# Altium project STM32F4.PrjPCB
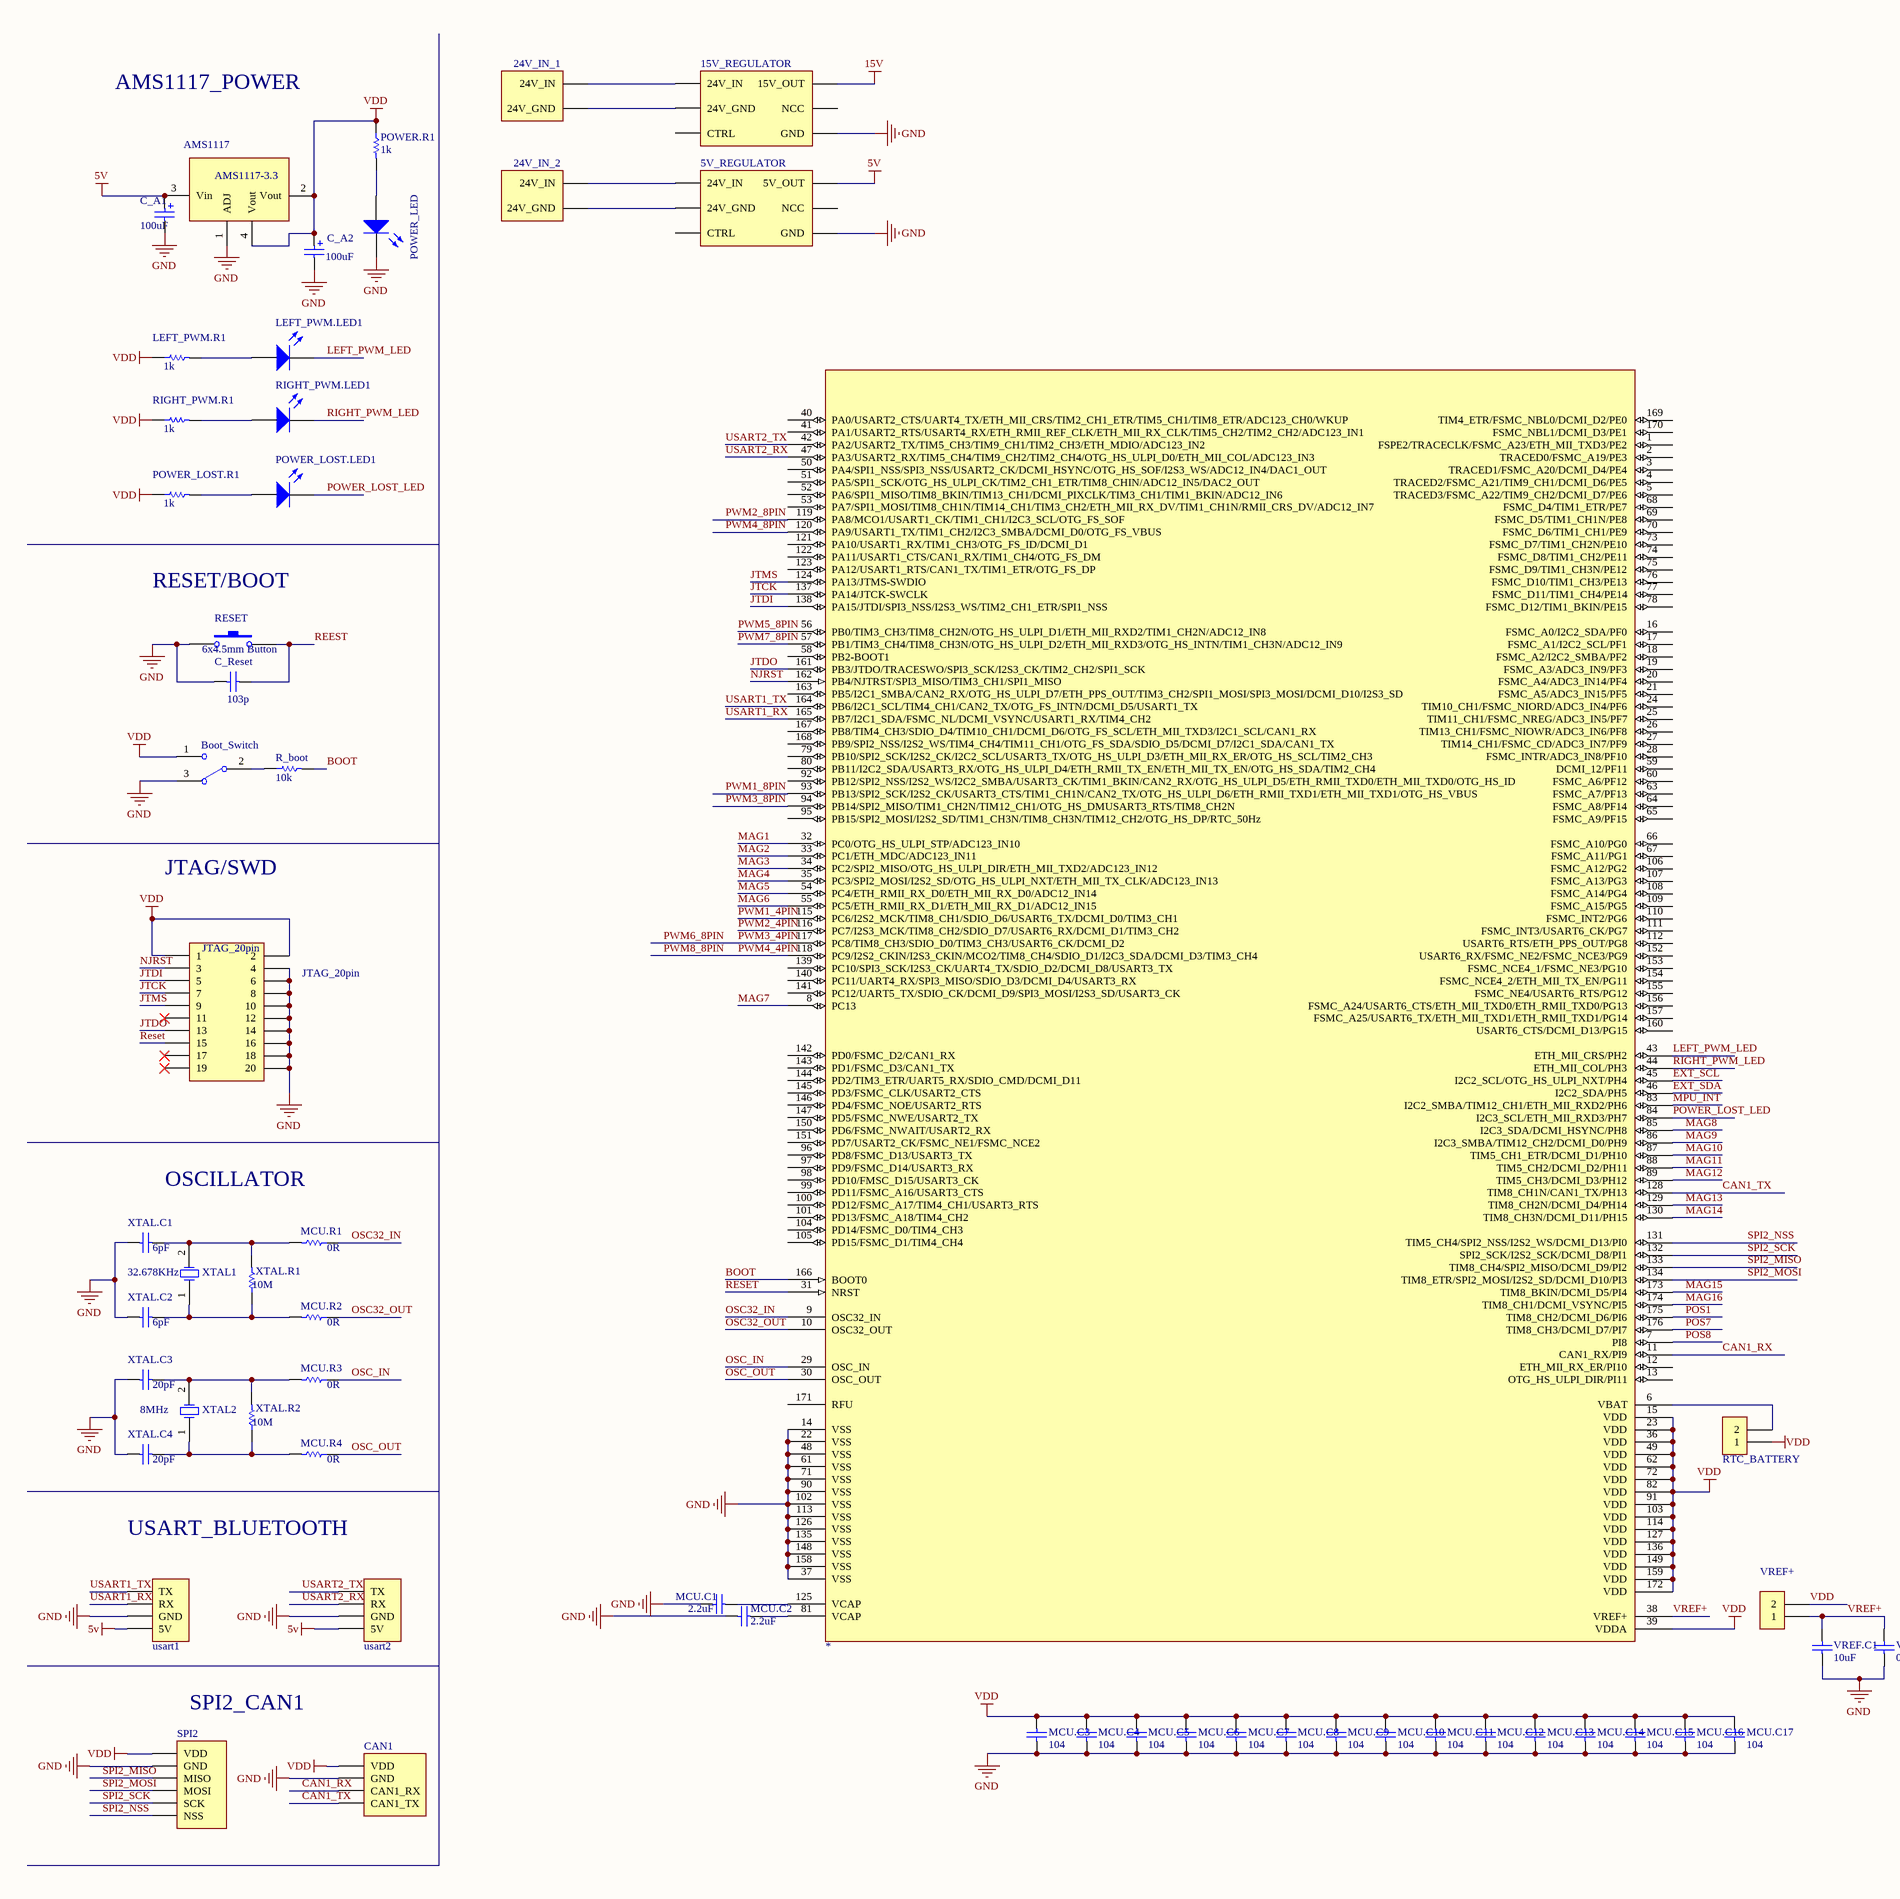
[diagram p0: STM32F4.SchDoc, left]
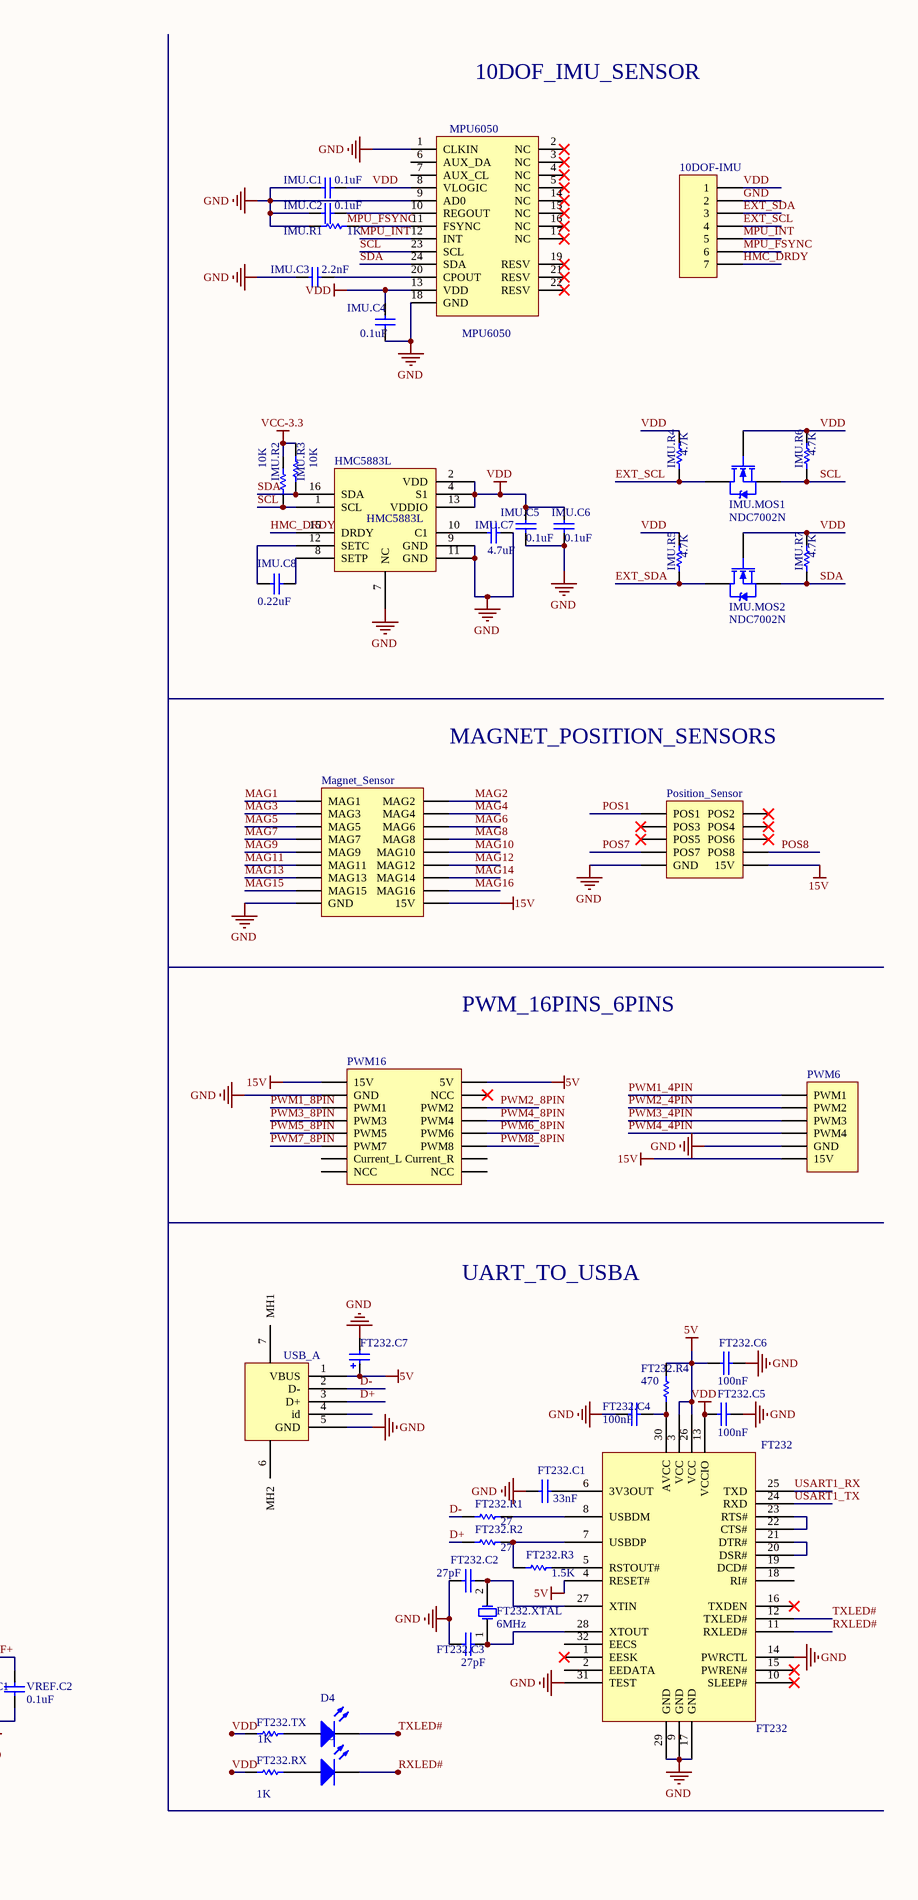
[diagram p1: STM32F4.SchDoc, right]
1 sheet, 100 parts. Net scope: global (net labels, ports and power ports of the same name join across sheets).
Board file: STM32F4.PcbDoc

## Sheet STM32F4.SchDoc
size A2

### Parts
5V_REGULATOR  5V_REGULATOR  [URA]  (value not drawn)
10DOF-IMU  *  [HEADER7]  (value not drawn)
15V_REGULATOR  15V_REGULATOR  [URA]  (value not drawn)
24V_IN_1  *  [Header2]  (value not drawn)
24V_IN_2  *  [Header2]  (value not drawn)
AMS1117  AMS1117  [AMS1117]  (value not drawn)
Boot_Switch  SW-SPDT  [TL36WW15050]  (value not drawn)
C_A1  value 100uF  [3528C/B]  (hidden comment: Cap Pol2)
C_A2  value 100uF  [3528C/B]  (hidden comment: Cap Pol2)
C_Reset  value 103p  [1608[0603]]  (hidden comment: Cap Semi)
CAN1  CAN1  [HEADER4]  (value not drawn)
D3  LED3  [LED]  (value not drawn)
D4  LED0  [LED]  (value not drawn)
FT232  FT232  [FT232]
FT232.C1  33nF  [1608[0603]]
FT232.C2  27pF  [1608[0603]]
FT232.C3  27pF  [1608[0603]]
FT232.C4  100nF  [1608[0603]]
FT232.C5  100nF  [1608[0603]]
FT232.C6  100nF  [1608[0603]]
FT232.C7  Cap Pol2  [3528C/B]  (value not drawn)
FT232.R1  value 27  [J1-0603]  (hidden comment: Res Semi)
FT232.R2  value 27  [J1-0603]  (hidden comment: Res Semi)
FT232.R3  value 1.5K  [J1-0603]  (hidden comment: Res Semi)
FT232.R4  value 470  [1608[0603]]  (hidden comment: Res1)
FT232.RX  value 1K  [1608[0603]]  (hidden comment: Res1)
FT232.TX  value 1K  [1608[0603]]  (hidden comment: Res1)
FT232.XTAL  6MHz  [xtal]
HMC5883L  HMC5883L  [HMC5883L]  (value not drawn)
IMU.C1  value 0.1uF  [1608[0603]]  (hidden comment: Cap Semi)
IMU.C2  value 0.1uF  [1608[0603]]  (hidden comment: Cap Semi)
IMU.C3  value 2.2nF  [1608[0603]]  (hidden comment: Cap Semi)
IMU.C4  value 0.1uF  [1608[0603]]  (hidden comment: Cap Semi)
IMU.C5  value 0.1uF  [1608[0603]]  (hidden comment: Cap Semi)
IMU.C6  value 0.1uF  [1608[0603]]  (hidden comment: Cap Semi)
IMU.C7  value 4.7uF  [1608[0603]]  (hidden comment: Cap Semi)
IMU.C8  value 0.22uF  [1608[0603]]  (hidden comment: Cap Semi)
IMU.MOS1  NDC7002N  [TO-220AB]
IMU.MOS2  NDC7002N  [TO-220AB]
IMU.R1  value 1K  [J1-0603]  (hidden comment: Res Semi)
IMU.R2  value 10K  [J1-0603]  (hidden comment: Res Semi)
IMU.R3  value 10K  [J1-0603]  (hidden comment: Res Semi)
IMU.R4  value 4.7K  [J1-0603]  (hidden comment: Res Semi)
IMU.R5  value 4.7K  [J1-0603]  (hidden comment: Res Semi)
IMU.R6  value 4.7K  [J1-0603]  (hidden comment: Res Semi)
IMU.R7  value 4.7K  [J1-0603]  (hidden comment: Res Semi)
JTAG_20pin  *  [JTAG]  (value not drawn)
LEFT_PWM.LED1  LED1  [LED]  (value not drawn)
LEFT_PWM.R1  value 1k  [J1-0603]  (hidden comment: Res Semi)
Magnet_Sensor  Magnet_Sensor  [HEADER18]  (value not drawn)
MCU.C1  value 2.2uF  [1608[0603]]  (hidden comment: Cap Semi)
MCU.C2  value 2.2uF  [1608[0603]]  (hidden comment: Cap Semi)
MCU.C3  value 104  [1608[0603]]  (hidden comment: Cap Semi)
MCU.C4  value 104  [1608[0603]]  (hidden comment: Cap Semi)
MCU.C5  value 104  [1608[0603]]  (hidden comment: Cap Semi)
MCU.C6  value 104  [1608[0603]]  (hidden comment: Cap Semi)
MCU.C7  value 104  [1608[0603]]  (hidden comment: Cap Semi)
MCU.C8  value 104  [1608[0603]]  (hidden comment: Cap Semi)
MCU.C9  value 104  [1608[0603]]  (hidden comment: Cap Semi)
MCU.C10  value 104  [1608[0603]]  (hidden comment: Cap Semi)
MCU.C11  value 104  [1608[0603]]  (hidden comment: Cap Semi)
MCU.C12  value 104  [1608[0603]]  (hidden comment: Cap Semi)
MCU.C13  value 104  [1608[0603]]  (hidden comment: Cap Semi)
MCU.C14  value 104  [1608[0603]]  (hidden comment: Cap Semi)
MCU.C15  value 104  [1608[0603]]  (hidden comment: Cap Semi)
MCU.C16  value 104  [1608[0603]]  (hidden comment: Cap Semi)
MCU.C17  value 104  [1608[0603]]  (hidden comment: Cap Semi)
MCU.R1  value 0R  [J1-0603]  (hidden comment: Res Semi)
MCU.R2  value 0R  [J1-0603]  (hidden comment: Res Semi)
MCU.R3  value 0R  [J1-0603]  (hidden comment: Res Semi)
MCU.R4  value 0R  [J1-0603]  (hidden comment: Res Semi)
MPU6050  *  [MPU6050]  (value not drawn)
Position_Sensor  Position_Sensor  [HEADER10]  (value not drawn)
POWER.R1  value 1k  [J1-0603]  (hidden comment: Res Semi)
POWER_LED  LED1  [LED]  (value not drawn)
POWER_LOST.LED1  LED1  [LED]  (value not drawn)
POWER_LOST.R1  value 1k  [J1-0603]  (hidden comment: Res Semi)
PWM6  Header 6  [HEADER6]  (value not drawn)
PWM16  PWM16  [HEADER16]  (value not drawn)
R_boot  value 10k  [J1-0603]  (hidden comment: 47k)
RESET  6x4.5mm Button  [Switch]
RIGHT_PWM.LED1  LED1  [LED]  (value not drawn)
RIGHT_PWM.R1  value 1k  [J1-0603]  (hidden comment: Res Semi)
RTC_BATTERY  *  [Header2]  (value not drawn)
SPI2  SPI2  [HEADER6]  (value not drawn)
usart1  Usart1  [HEADER4]  (value not drawn)
usart2  Usart2  [HEADER4]  (value not drawn)
USB_A  USB_A  [Micro_USB]  (value not drawn)
VREF+  *  [Header2]  (value not drawn)
VREF.C1  value 10uF  [1608[0603]]  (hidden comment: Cap Semi)
VREF.C2  value 0.1uF  [1608[0603]]  (hidden comment: Cap Semi)
XTAL1  32.678KHz  [xtal]
XTAL2  8MHz  [xtal]
XTAL.C1  value 6pF  [1608[0603]]  (hidden comment: Cap Semi)
XTAL.C2  value 6pF  [1608[0603]]  (hidden comment: Cap Semi)
XTAL.C3  value 20pF  [1608[0603]]  (hidden comment: Cap Semi)
XTAL.C4  value 20pF  [1608[0603]]  (hidden comment: Cap Semi)
XTAL.R1  value 10M  [J1-0603]  (hidden comment: Res Semi)
XTAL.R2  value 10M  [J1-0603]  (hidden comment: Res Semi)
  *  [U-LQFP176-0.5]

### Nets
5V: 5V_REGULATOR.3(5V_OUT) AMS1117.3(Vin) C_A1.1 FT232.3(VCC) FT232.4(RESET#) FT232.26(VCC) FT232.C6.2 FT232.C7.1 FT232.R4.1 PWM16.2(5V) usart1.4(5V) usart2.4(5V) USB_A.1(VBUS)
15V: 15V_REGULATOR.3(15V_OUT) Magnet_Sensor.18(15V) Position_Sensor.10(15V) PWM6.6(15V) PWM16.1(15V)
GND: 5V_REGULATOR.5(GND) 10DOF-IMU.2 15V_REGULATOR.5(GND) AMS1117.1(ADJ) Boot_Switch.3 C_A1.2 C_A2.2 C_Reset.1 CAN1.2(GND) FT232.9(GND) FT232.14(PWRCTL) FT232.17(GND) FT232.29(GND) FT232.31(TEST) FT232.C1.2 FT232.C2.2 FT232.C3.2 FT232.C4.2 FT232.C5.1 FT232.C6.1 FT232.C7.2 HMC5883L.7(NC) HMC5883L.9(GND) HMC5883L.11(GND) IMU.C1.1 IMU.C2.1 IMU.C3.1 IMU.C4.1 IMU.C5.2 IMU.C6.2 IMU.C7.2 IMU.R1.2 JTAG_20pin.4 JTAG_20pin.6 JTAG_20pin.8 JTAG_20pin.10 JTAG_20pin.12 JTAG_20pin.14 JTAG_20pin.16 JTAG_20pin.18 JTAG_20pin.20 Magnet_Sensor.17(GND) MCU.C1.1 MCU.C2.1 MCU.C3.1 MCU.C4.1 MCU.C5.1 MCU.C6.1 MCU.C7.1 MCU.C8.1 MCU.C9.1 MCU.C10.1 MCU.C11.1 MCU.C12.1 MCU.C13.1 MCU.C14.1 MCU.C15.1 MCU.C16.1 MCU.C17.1 MPU6050.1(CLKIN) MPU6050.9(AD0) MPU6050.18(GND) Position_Sensor.9(GND) POWER_LED.2(K) PWM6.5(GND) PWM16.3(GND) RESET.1 SPI2.2(GND) usart1.3(GND) usart2.3(GND) USB_A.5(GND) VREF.C1.1 VREF.C2.1 XTAL.C1.1 XTAL.C2.1 XTAL.C3.1 XTAL.C4.1 .14(VSS) .22(VSS) .37(VSS) .48(VSS) .61(VSS) .71(VSS) .90(VSS) .102(VSS) .113(VSS) .126(VSS) .135(VSS) .148(VSS) .158(VSS)
VCC-3.3: IMU.R2.2 IMU.R3.2
VDD: 10DOF-IMU.1 AMS1117.2(Vout) AMS1117.4(Vout) Boot_Switch.1 C_A2.1 CAN1.1(VDD) FT232.13(VCCIO) FT232.C5.2 FT232.RX.1 FT232.TX.1 HMC5883L.2(VDD) HMC5883L.4(S1) HMC5883L.13(VDDIO) IMU.C1.2 IMU.C4.2 IMU.C5.1 IMU.C6.1 IMU.MOS1.1(G) IMU.MOS2.1(G) IMU.R4.2 IMU.R5.2 IMU.R6.2 IMU.R7.2 JTAG_20pin.1 JTAG_20pin.2 LEFT_PWM.R1.1 MCU.C3.2 MCU.C4.2 MCU.C5.2 MCU.C6.2 MCU.C7.2 MCU.C8.2 MCU.C9.2 MCU.C10.2 MCU.C11.2 MCU.C12.2 MCU.C13.2 MCU.C14.2 MCU.C15.2 MCU.C16.2 MCU.C17.2 MPU6050.8(VLOGIC) MPU6050.13(VDD) POWER.R1.1 POWER_LOST.R1.1 RIGHT_PWM.R1.1 RTC_BATTERY.1 SPI2.1(VDD) VREF+.2 .15(VDD) .23(VDD) .36(VDD) .39(VDDA) .49(VDD) .62(VDD) .72(VDD) .82(VDD) .91(VDD) .103(VDD) .114(VDD) .127(VDD) .136(VDD) .149(VDD) .159(VDD) .172(VDD)
BOOT: R_boot.2 .166(BOOT0)
CAN1_RX: CAN1.3(CAN1_RX) .11(CAN1_RX/PI9)
CAN1_TX: CAN1.4(CAN1_TX) .128(TIM8_CH1N/CAN1_TX/PH13)
D+: FT232.R2.2 USB_A.3(D+)
D-: FT232.R1.2 USB_A.2(D-)
EXT_SCL: 10DOF-IMU.4 IMU.MOS1.2(D) IMU.R4.1 .45(I2C2_SCL/OTG_HS_ULPI_NXT/PH4)
EXT_SDA: 10DOF-IMU.3 IMU.MOS2.2(D) IMU.R5.1 .46(I2C2_SDA/PH5)
HMC_DRDY: 10DOF-IMU.7 HMC5883L.15(DRDY)
JTCK: JTAG_20pin.7 .137(PA14/JTCK-SWCLK)
JTDI: JTAG_20pin.5 .138(PA15/JTDI/SPI3_NSS/I2S3_WS/TIM2_CH1_ETR/SPI1_NSS)
JTDO: JTAG_20pin.13 .161(PB3/JTDO/TRACESWO/SPI3_SCK/I2S3_CK/TIM2_CH2/SPI1_SCK)
JTMS: JTAG_20pin.9 .124(PA13/JTMS-SWDIO)
LEFT_PWM_LED: LEFT_PWM.LED1.2(K) .43(ETH_MII_CRS/PH2)
MAG1: Magnet_Sensor.1(MAG1) .32(PC0/OTG_HS_ULPI_STP/ADC123_IN10)
MAG2: Magnet_Sensor.2(MAG2) .33(PC1/ETH_MDC/ADC123_IN11)
MAG3: Magnet_Sensor.3(MAG3) .34(PC2/SPI2_MISO/OTG_HS_ULPI_DIR/ETH_MII_TXD2/ADC123_IN12)
MAG4: Magnet_Sensor.4(MAG4) .35(PC3/SPI2_MOSI/I2S2_SD/OTG_HS_ULPI_NXT/ETH_MII_TX_CLK/ADC123_IN13)
MAG5: Magnet_Sensor.5(MAG5) .54(PC4/ETH_RMII_RX_D0/ETH_MII_RX_D0/ADC12_IN14)
MAG6: Magnet_Sensor.6(MAG6) .55(PC5/ETH_RMII_RX_D1/ETH_MII_RX_D1/ADC12_IN15)
MAG7: Magnet_Sensor.7(MAG7) .8(PC13)
MAG8: Magnet_Sensor.8(MAG8) .85(I2C3_SDA/DCMI_HSYNC/PH8)
MAG9: Magnet_Sensor.9(MAG9) .86(I2C3_SMBA/TIM12_CH2/DCMI_D0/PH9)
MAG10: Magnet_Sensor.10(MAG10) .87(TIM5_CH1_ETR/DCMI_D1/PH10)
MAG11: Magnet_Sensor.11(MAG11) .88(TIM5_CH2/DCMI_D2/PH11)
MAG12: Magnet_Sensor.12(MAG12) .89(TIM5_CH3/DCMI_D3/PH12)
MAG13: Magnet_Sensor.13(MAG13) .129(TIM8_CH2N/DCMI_D4/PH14)
MAG14: Magnet_Sensor.14(MAG14) .130(TIM8_CH3N/DCMI_D11/PH15)
MAG15: Magnet_Sensor.15(MAG15) .173(TIM8_BKIN/DCMI_D5/PI4)
MAG16: Magnet_Sensor.16(MAG16) .174(TIM8_CH1/DCMI_VSYNC/PI5)
MPU_FSYNC: 10DOF-IMU.6
MPU_INT: 10DOF-IMU.5 MPU6050.12(INT) .83(I2C2_SMBA/TIM12_CH1/ETH_MII_RXD2/PH6)
NJRST: JTAG_20pin.3 .162(PB4/NJTRST/SPI3_MISO/TIM3_CH1/SPI1_MISO)
OSC32_IN: MCU.R1.1 .9(OSC32_IN)
OSC32_OUT: MCU.R2.1 .10(OSC32_OUT)
OSC_IN: MCU.R3.1 .29(OSC_IN)
OSC_OUT: MCU.R4.1 .30(OSC_OUT)
POS1: Position_Sensor.1(POS1) .175(TIM8_CH2/DCMI_D6/PI6)
POS7: Position_Sensor.7(POS7) .176(TIM8_CH3/DCMI_D7/PI7)
POS8: Position_Sensor.8(POS8) .7(PI8)
POWER_LOST_LED: POWER_LOST.LED1.2(K) .84(I2C3_SCL/ETH_MII_RXD3/PH7)
PWM1_4PIN: PWM6.1(PWM1) .115(PC6/I2S2_MCK/TIM8_CH1/SDIO_D6/USART6_TX/DCMI_D0/TIM3_CH1)
PWM1_8PIN: PWM16.5(PWM1) .93(PB13/SPI2_SCK/I2S2_CK/USART3_CTS/TIM1_CH1N/CAN2_TX/OTG_HS_ULPI_D6/ETH_RMII_TXD1/ETH_MII_TXD1/OTG_HS_VBUS)
PWM2_4PIN: PWM6.2(PWM2) .116(PC7/I2S3_MCK/TIM8_CH2/SDIO_D7/USART6_RX/DCMI_D1/TIM3_CH2)
PWM2_8PIN: PWM16.6(PWM2) .119(PA8/MCO1/USART1_CK/TIM1_CH1/I2C3_SCL/OTG_FS_SOF)
PWM3_4PIN: PWM6.3(PWM3) PWM16.10(PWM6) .117(PC8/TIM8_CH3/SDIO_D0/TIM3_CH3/USART6_CK/DCMI_D2)  [also labelled PWM6_8PIN]
PWM3_8PIN: PWM16.7(PWM3) .94(PB14/SPI2_MISO/TIM1_CH2N/TIM12_CH1/OTG_HS_DMUSART3_RTS/TIM8_CH2N)
PWM4_4PIN: PWM6.4(PWM4) PWM16.12(PWM8) .118(PC9/I2S2_CKIN/I2S3_CKIN/MCO2/TIM8_CH4/SDIO_D1/I2C3_SDA/DCMI_D3/TIM3_CH4)  [also labelled PWM8_8PIN]
PWM4_8PIN: PWM16.8(PWM4) .120(PA9/USART1_TX/TIM1_CH2/I2C3_SMBA/DCMI_D0/OTG_FS_VBUS)
PWM5_8PIN: PWM16.9(PWM5) .56(PB0/TIM3_CH3/TIM8_CH2N/OTG_HS_ULPI_D1/ETH_MII_RXD2/TIM1_CH2N/ADC12_IN8)
PWM7_8PIN: PWM16.11(PWM7) .57(PB1/TIM3_CH4/TIM8_CH3N/OTG_HS_ULPI_D2/ETH_MII_RXD3/OTG_HS_INTN/TIM1_CH3N/ADC12_IN9)
REEST: C_Reset.2 RESET.2
RESET: JTAG_20pin.15 .31(NRST)
RIGHT_PWM_LED: RIGHT_PWM.LED1.2(K) .44(ETH_MII_COL/PH3)
RXLED#: D3.2(K) FT232.11(RXLED#)
SCL: HMC5883L.1(SCL) IMU.MOS1.3(S) IMU.R2.1 IMU.R6.1 MPU6050.23(SCL)
SDA: HMC5883L.16(SDA) IMU.MOS2.3(S) IMU.R3.1 IMU.R7.1 MPU6050.24(SDA)
SPI2_MISO: SPI2.3(MISO) .133(TIM8_CH4/SPI2_MISO/DCMI_D9/PI2)
SPI2_MOSI: SPI2.4(MOSI) .134(TIM8_ETR/SPI2_MOSI/I2S2_SD/DCMI_D10/PI3)
SPI2_NSS: SPI2.6(NSS) .131(TIM5_CH4/SPI2_NSS/I2S2_WS/DCMI_D13/PI0)
SPI2_SCK: SPI2.5(SCK) .132(SPI2_SCK/I2S2_SCK/DCMI_D8/PI1)
TXLED#: D4.2(K) FT232.12(TXLED#)
USART1_RX: FT232.25(TXD) usart1.2(RX) .165(PB7/I2C1_SDA/FSMC_NL/DCMI_VSYNC/USART1_RX/TIM4_CH2)
USART1_TX: FT232.24(RXD) usart1.1(TX) .164(PB6/I2C1_SCL/TIM4_CH1/CAN2_TX/OTG_FS_INTN/DCMI_D5/USART1_TX)
USART2_RX: usart2.2(RX) .47(PA3/USART2_RX/TIM5_CH4/TIM9_CH2/TIM2_CH4/OTG_HS_ULPI_D0/ETH_MII_COL/ADC123_IN3)
USART2_TX: usart2.1(TX) .42(PA2/USART2_TX/TIM5_CH3/TIM9_CH1/TIM2_CH3/ETH_MDIO/ADC123_IN2)
VREF+: VREF+.1 VREF.C1.2 VREF.C2.2 .38(VREF+)
Net5V_REGULATOR_1: 5V_REGULATOR.1(24V_GND) 24V_IN_2.2(24V_GND)
Net5V_REGULATOR_2: 5V_REGULATOR.2(24V_IN) 24V_IN_2.1(24V_IN)
Net15V_REGULATOR_1: 15V_REGULATOR.1(24V_GND) 24V_IN_1.2(24V_GND)
Net15V_REGULATOR_2: 15V_REGULATOR.2(24V_IN) 24V_IN_1.1(24V_IN)
NetBoot_Switch_2: Boot_Switch.2 R_boot.1
NetD3_1: D3.1(A) FT232.RX.2
NetD4_1: D4.1(A) FT232.TX.2
NetFT232_5: FT232.5(RSTOUT#) FT232.R3.1
NetFT232_6: FT232.6(3V3OUT) FT232.C1.1
NetFT232_7: FT232.7(USBDP) FT232.R2.1 FT232.R3.2
NetFT232_8: FT232.8(USBDM) FT232.R1.1
NetFT232_20: FT232.20(DSR#) FT232.21(DTR#)
NetFT232_22: FT232.22(CTS#) FT232.23(RTS#)
NetFT232_27: FT232.27(XTIN) FT232.C2.1 FT232.XTAL.2(OSC2)
NetFT232_28: FT232.28(XTOUT) FT232.C3.1 FT232.XTAL.1(OSC1)
NetFT232_30: FT232.30(AVCC) FT232.C4.1 FT232.R4.2
NetHMC5883L_8: HMC5883L.8(SETP) IMU.C8.2
NetHMC5883L_10: HMC5883L.10(C1) IMU.C7.1
NetHMC5883L_12: HMC5883L.12(SETC) IMU.C8.1
NetIMU.C2_2: IMU.C2.2 MPU6050.10(REGOUT)
NetIMU.C3_2: IMU.C3.2 MPU6050.20(CPOUT)
NetIMU.R1_1: IMU.R1.1 MPU6050.11(FSYNC)
NetLEFT_PWM.LED1_1: LEFT_PWM.LED1.1(A) LEFT_PWM.R1.2
NetMCU.C1_2: MCU.C1.2 .125(VCAP)
NetMCU.C2_2: MCU.C2.2 .81(VCAP)
NetMCU.R1_2: MCU.R1.2 XTAL1.2(OSC2) XTAL.C1.2 XTAL.R1.2
NetMCU.R2_2: MCU.R2.2 XTAL1.1(OSC1) XTAL.C2.2 XTAL.R1.1
NetMCU.R3_2: MCU.R3.2 XTAL2.2(OSC2) XTAL.C3.2 XTAL.R2.2
NetMCU.R4_2: MCU.R4.2 XTAL2.1(OSC1) XTAL.C4.2 XTAL.R2.1
NetPOWER.R1_2: POWER.R1.2 POWER_LED.1(A)
NetPOWER_LOST.LED1_1: POWER_LOST.LED1.1(A) POWER_LOST.R1.2
NetRIGHT_PWM.LED1_1: RIGHT_PWM.LED1.1(A) RIGHT_PWM.R1.2
NetRTC_BATTERY_2: RTC_BATTERY.2 .6(VBAT)

Not connected (* = marked no-connect by the designer): 5V_REGULATOR 4(NCC) 6(CTRL); 15V_REGULATOR 4(NCC) 6(CTRL); FT232 1(EESK)* 2(EEDATA) 10(SLEEP#)* 15(PWREN#)* 16(TXDEN)* 18(RI#) 19(DCD#) 32(EECS); JTAG_20pin 11* 17* 19*; MPU6050 2(NC)* 3(NC)* 4(NC)* 5(NC)* 6(AUX_DA) 7(AUX_CL) 14(NC)* 15(NC)* 16(NC)* 17(NC)* 19(RESV)* 21(RESV)* 22(RESV)*; Position_Sensor 2(POS2)* 3(POS3)* 4(POS4)* 5(POS5)* 6(POS6)*; PWM16 4(NCC)* 13(Current_L) 14(Current_R) 15(NCC) 16(NCC); USB_A 4(id) 6(MH2) 7(MH1);  1(FSPE2/TRACECLK/FSMC_A23/ETH_MII_TXD3/PE2) 2(TRACED0/FSMC_A19/PE3) 3(TRACED1/FSMC_A20/DCMI_D4/PE4) 4(TRACED2/FSMC_A21/TIM9_CH1/DCMI_D6/PE5) 5(TRACED3/FSMC_A22/TIM9_CH2/DCMI_D7/PE6) 12(ETH_MII_RX_ER/PI10) 13(OTG_HS_ULPI_DIR/PI11) 16(FSMC_A0/I2C2_SDA/PF0) 17(FSMC_A1/I2C2_SCL/PF1) 18(FSMC_A2/I2C2_SMBA/PF2) 19(FSMC_A3/ADC3_IN9/PF3) 20(FSMC_A4/ADC3_IN14/PF4) 21(FSMC_A5/ADC3_IN15/PF5) 24(TIM10_CH1/FSMC_NIORD/ADC3_IN4/PF6) 25(TIM11_CH1/FSMC_NREG/ADC3_IN5/PF7) 26(TIM13_CH1/FSMC_NIOWR/ADC3_IN6/PF8) 27(TIM14_CH1/FSMC_CD/ADC3_IN7/PF9) 28(FSMC_INTR/ADC3_IN8/PF10) 40(PA0/USART2_CTS/UART4_TX/ETH_MII_CRS/TIM2_CH1_ETR/TIM5_CH1/TIM8_ETR/ADC123_CH0/WKUP) 41(PA1/USART2_RTS/USART4_RX/ETH_RMII_REF_CLK/ETH_MII_RX_CLK/TIM5_CH2/TIM2_CH2/ADC123_IN1) 50(PA4/SPI1_NSS/SPI3_NSS/USART2_CK/DCMI_HSYNC/OTG_HS_SOF/I2S3_WS/ADC12_IN4/DAC1_OUT) 51(PA5/SPI1_SCK/OTG_HS_ULPI_CK/TIM2_CH1_ETR/TIM8_CHIN/ADC12_IN5/DAC2_OUT) 52(PA6/SPI1_MISO/TIM8_BKIN/TIM13_CH1/DCMI_PIXCLK/TIM3_CH1/TIM1_BKIN/ADC12_IN6) 53(PA7/SPI1_MOSI/TIM8_CH1N/TIM14_CH1/TIM3_CH2/ETH_MII_RX_DV/TIM1_CH1N/RMII_CRS_DV/ADC12_IN7) 58(PB2-BOOT1) 59(DCMI_12/PF11) 60(FSMC_A6/PF12) 63(FSMC_A7/PF13) 64(FSMC_A8/PF14) 65(FSMC_A9/PF15) 66(FSMC_A10/PG0) 67(FSMC_A11/PG1) 68(FSMC_D4/TIM1_ETR/PE7) 69(FSMC_D5/TIM1_CH1N/PE8) 70(FSMC_D6/TIM1_CH1/PE9) 73(FSMC_D7/TIM1_CH2N/PE10) 74(FSMC_D8/TIM1_CH2/PE11) 75(FSMC_D9/TIM1_CH3N/PE12) 76(FSMC_D10/TIM1_CH3/PE13) 77(FSMC_D11/TIM1_CH4/PE14) 78(FSMC_D12/TIM1_BKIN/PE15) 79(PB10/SPI2_SCK/I2S2_CK/I2C2_SCL/USART3_TX/OTG_HS_ULPI_D3/ETH_MII_RX_ER/OTG_HS_SCL/TIM2_CH3) 80(PB11/I2C2_SDA/USART3_RX/OTG_HS_ULPI_D4/ETH_RMII_TX_EN/ETH_MII_TX_EN/OTG_HS_SDA/TIM2_CH4) 92(PB12/SPI2_NSS/I2S2_WS/I2C2_SMBA/USART3_CK/TIM1_BKIN/CAN2_RX/OTG_HS_ULPI_D5/ETH_RMII_TXD0/ETH_MII_TXD0/OTG_HS_ID) 95(PB15/SPI2_MOSI/I2S2_SD/TIM1_CH3N/TIM8_CH3N/TIM12_CH2/OTG_HS_DP/RTC_50Hz) 96(PD8/FSMC_D13/USART3_TX) 97(PD9/FSMC_D14/USART3_RX) 98(PD10/FMSC_D15/USART3_CK) 99(PD11/FSMC_A16/USART3_CTS) 100(PD12/FSMC_A17/TIM4_CH1/USART3_RTS) 101(PD13/FSMC_A18/TIM4_CH2) 104(PD14/FSMC_D0/TIM4_CH3) 105(PD15/FSMC_D1/TIM4_CH4) 106(FSMC_A12/PG2) 107(FSMC_A13/PG3) 108(FSMC_A14/PG4) 109(FSMC_A15/PG5) 110(FSMC_INT2/PG6) 111(FSMC_INT3/USART6_CK/PG7) 112(USART6_RTS/ETH_PPS_OUT/PG8) 121(PA10/USART1_RX/TIM1_CH3/OTG_FS_ID/DCMI_D1) 122(PA11/USART1_CTS/CAN1_RX/TIM1_CH4/OTG_FS_DM) 123(PA12/USART1_RTS/CAN1_TX/TIM1_ETR/OTG_FS_DP) 139(PC10/SPI3_SCK/I2S3_CK/UART4_TX/SDIO_D2/DCMI_D8/USART3_TX) 140(PC11/UART4_RX/SPI3_MISO/SDIO_D3/DCMI_D4/USART3_RX) 141(PC12/UART5_TX/SDIO_CK/DCMI_D9/SPI3_MOSI/I2S3_SD/USART3_CK) 142(PD0/FSMC_D2/CAN1_RX) 143(PD1/FSMC_D3/CAN1_TX) 144(PD2/TIM3_ETR/UART5_RX/SDIO_CMD/DCMI_D11) 145(PD3/FSMC_CLK/USART2_CTS) 146(PD4/FSMC_NOE/USART2_RTS) 147(PD5/FSMC_NWE/USART2_TX) 150(PD6/FSMC_NWAIT/USART2_RX) 151(PD7/USART2_CK/FSMC_NE1/FSMC_NCE2) 152(USART6_RX/FSMC_NE2/FSMC_NCE3/PG9) 153(FSMC_NCE4_1/FSMC_NE3/PG10) 154(FSMC_NCE4_2/ETH_MII_TX_EN/PG11) 155(FSMC_NE4/USART6_RTS/PG12) 156(FSMC_A24/USART6_CTS/ETH_MII_TXD0/ETH_RMII_TXD0/PG13) 157(FSMC_A25/USART6_TX/ETH_MII_TXD1/ETH_RMII_TXD1/PG14) 160(USART6_CTS/DCMI_D13/PG15) 163(PB5/I2C1_SMBA/CAN2_RX/OTG_HS_ULPI_D7/ETH_PPS_OUT/TIM3_CH2/SPI1_MOSI/SPI3_MOSI/DCMI_D10/I2S3_SD) 167(PB8/TIM4_CH3/SDIO_D4/TIM10_CH1/DCMI_D6/OTG_FS_SCL/ETH_MII_TXD3/I2C1_SCL/CAN1_RX) 168(PB9/SPI2_NSS/I2S2_WS/TIM4_CH4/TIM11_CH1/OTG_FS_SDA/SDIO_D5/DCMI_D7/I2C1_SDA/CAN1_TX) 169(TIM4_ETR/FSMC_NBL0/DCMI_D2/PE0) 170(FSMC_NBL1/DCMI_D3/PE1) 171(RFU)

### Notes on the sheet
- AMS1117_POWER
- 10DOF_IMU_SENSOR
- RESET/BOOT
- MAGNET_POSITION_SENSORS
- JTAG/SWD
- PWM_16PINS_6PINS
- OSCILLATOR
- UART_TO_USBA
- USART_BLUETOOTH
- (near SPI2) SPI2_CAN1
- Labels drawn without touching a wire or pin: MPU_FSYNC
- (in symbol AMS1117) AMS1117-3.3

### Library data of the parts
5V_REGULATOR = 5V_REGULATOR_1: Header, 6-Pin; LatestRevisionDate: 17-Jul-2002; LatestRevisionNote: Re-released for DXP Platform.; Publisher: Altium Limited
10DOF-IMU = 10DOF-IMU
15V_REGULATOR = 15V_REGULATOR: Header, 6-Pin; LatestRevisionDate: 17-Jul-2002; LatestRevisionNote: Re-released for DXP Platform.; Publisher: Altium Limited
24V_IN_1 24V_IN_2 = 24V_IN
Boot_Switch = SW-SPDT: SPDT Subminiature Toggle Switch, Right Angle Mounting, Vertical Actuation; Published: 24-Mar-1999; LatestRevisionDate: 17-Dec-2003; LatestRevisionNote: Schematic revised, PCB Footprint replaced.; DatasheetVersion: 05-Dec-2000; PackageReference: TL36WW15050; Publisher: Altium Limited; PackageDescription: Switch; 4 Leads; ComponentLink1Description: Manufacturer Link; ComponentLink1URL: http://www.apem.com
C_A1 C_A2 = Cap Pol2: Polarized Capacitor (Axial); Published: 8-Jun-2000; LatestRevisionDate: 17-Jul-2002; LatestRevisionNote: Re-released for DXP Platform.; PackageReference: POLAR0.8; Publisher: Altium Limited
C_Reset IMU.C1-IMU.C8 MCU.C1-MCU.C17 VREF.C1 VREF.C2 XTAL.C1-XTAL.C4 = Cap Semi: Capacitor (Semiconductor SIM Model); Published: 8-Jun-2000; PackageReference: C1206; Publisher: Altium Limited
  C_Reset IMU.C1-IMU.C4 MCU.C1-MCU.C17 VREF.C1 VREF.C2 XTAL.C1-XTAL.C4: LatestRevisionDate: 29-May-2009; LatestRevisionNote: IPC-7351 Footprint Added.; PackageDescription: Chip Capacitor
  IMU.C5-IMU.C8: LatestRevisionDate: 17-Jul-2002; LatestRevisionNote: Re-released for DXP Platform.
CAN1 = CAN1: Header, 6-Pin; LatestRevisionDate: 17-Jul-2002; LatestRevisionNote: Re-released for DXP Platform.; Publisher: Altium Limited
D3 D4 = LED0: Typical INFRARED GaAs LED; Published: 8-Jun-2000; LatestRevisionDate: 08-Jul-2005; LatestRevisionNote: Mech Layer 1 removed.; PackageReference: LED-0; Publisher: Altium Limited; PackageDescription: LED; 2 Leads
FT232 = FT232BM
FT232.C1-FT232.C6 = CAP: Capacitor
  FT232.C1: value: 33nF
  FT232.C2 FT232.C3: value: 27pF
  FT232.C4-FT232.C6: value: 100nF
FT232.C7 = Cap Pol2: Polarized Capacitor (Axial); Value: 100uF; Published: 8-Jun-2000; LatestRevisionDate: 17-Jul-2002; LatestRevisionNote: Re-released for DXP Platform.; PackageReference: POLAR0.8; Publisher: Altium Limited
FT232.R1-FT232.R3 IMU.R1-IMU.R7 LEFT_PWM.R1 MCU.R1-MCU.R4 POWER.R1 POWER_LOST.R1 R_boot RIGHT_PWM.R1 XTAL.R1 XTAL.R2 = Res Semi: Semiconductor Resistor; Published: 8-Jun-2000; Publisher: Altium Limited; LatestRevisionDate: 17-Jul-2002; LatestRevisionNote: Re-released for DXP Platform.; PackageReference: AXIAL-0.5
  IMU.R1 LEFT_PWM.R1 MCU.R1-MCU.R4 POWER.R1 POWER_LOST.R1 RIGHT_PWM.R1 XTAL.R1 XTAL.R2: PackageDescription: Axial Device, Thru-Hole; 2 Leads; 0.5 in Pin Spacing
FT232.R4 FT232.RX FT232.TX = Res1: Resistor; Published: 8-Jun-2000; LatestRevisionDate: 17-Jul-2002; LatestRevisionNote: Re-released for DXP Platform.; PackageReference: AXIAL-0.3; Publisher: Altium Limited; PackageDescription: Axial Device, Thru-Hole; 2 Leads; 0.3 in Pin Spacing
FT232.XTAL XTAL1 XTAL2 = XTAL: Crystal Oscillator; Published: *; Publisher: *; Manufacturer: *; Class: *; SubClass: *
IMU.MOS1 IMU.MOS2 = NMOS-2: N-Channel Power MOSFET; Note: Pin 2 is electrically connected to pin 4.; Published: 8-Jun-2000; LatestRevisionDate: 17-Jul-2002; LatestRevisionNote: Re-released for DXP Platform.; DatasheetVersion: PD-9.814; PackageVersion: Feb-1997; PackageReference: TO-220AB; Publisher: Altium Limited; PackageDescription: TO, Thru-Hole, Vertical, Heatsink Mounted; 3 In-Line Leads; Pitch 2.54 mm; ComponentLink1Description: Manufacturer Link; ComponentLink1URL: http://www.irf.com/
JTAG_20pin = JTAG_20pin
LEFT_PWM.LED1 POWER_LED POWER_LOST.LED1 RIGHT_PWM.LED1 = LED1: Typical RED GaAs LED; Published: 8-Jun-2000; Publisher: Altium Limited; LatestRevisionDate: 08-Jul-2005; LatestRevisionNote: Mech Layer 1 removed.; PackageReference: LED-1
Magnet_Sensor = Magnet_Sensor: Header, 6-Pin; LatestRevisionDate: 17-Jul-2002; LatestRevisionNote: Re-released for DXP Platform.; Publisher: Altium Limited
MPU6050 = MPU6050
Position_Sensor = Position_Sensor: Header, 6-Pin; LatestRevisionDate: 17-Jul-2002; LatestRevisionNote: Re-released for DXP Platform.; Publisher: Altium Limited
PWM6 = PWM6: Header, 6-Pin; LatestRevisionDate: 17-Jul-2002; LatestRevisionNote: Re-released for DXP Platform.; Publisher: Altium Limited
PWM16 = PWM16: Header, 6-Pin; LatestRevisionDate: 17-Jul-2002; LatestRevisionNote: Re-released for DXP Platform.; Publisher: Altium Limited
RESET = SW-PB: Switch; Published: 24-Mar-1999; LatestRevisionDate: 17-Jul-2002; LatestRevisionNote: Re-released for DXP Platform.; PackageReference: SPST-2; Publisher: Altium Limited
RTC_BATTERY VREF+ = Header2
SPI2 = SPI2: Header, 6-Pin; LatestRevisionDate: 17-Jul-2002; LatestRevisionNote: Re-released for DXP Platform.; Publisher: Altium Limited
usart1 = Usart2
 = STM32F407IGT6